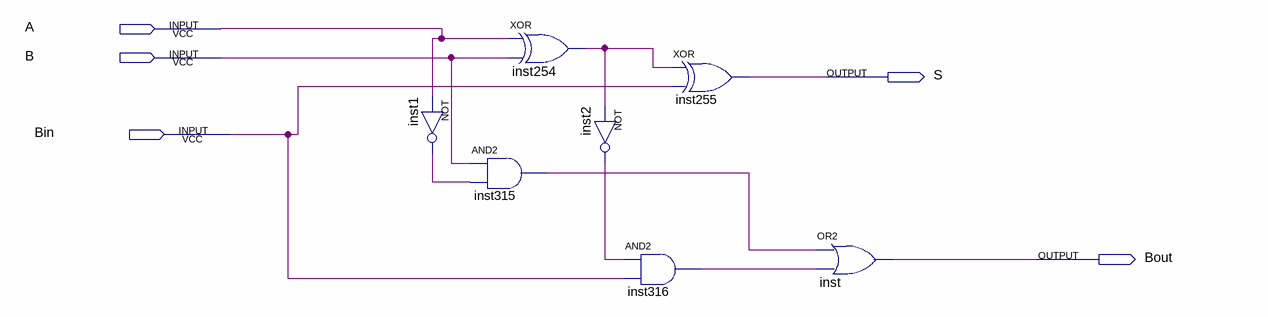
[diagram p0: schematic sheet]
// Quartus schematic Block2.bdf as structural Verilog: 7 symbols, 5 pins
module Block2 (
  input  A,
  input  B,
  input  Bin,
  output S,
  output Bout
);

  wire inst1_out, inst2_out, inst254_out, inst315_out, inst316_out;

  not inst1 (inst1_out, A);
  xor inst254 (inst254_out, A, B);
  and inst315 (inst315_out, B, inst1_out);
  not inst2 (inst2_out, inst254_out);
  and inst316 (inst316_out, inst2_out, Bin);
  xor inst255 (S, inst254_out, Bin);
  or inst (Bout, inst315_out, inst316_out);
endmodule
